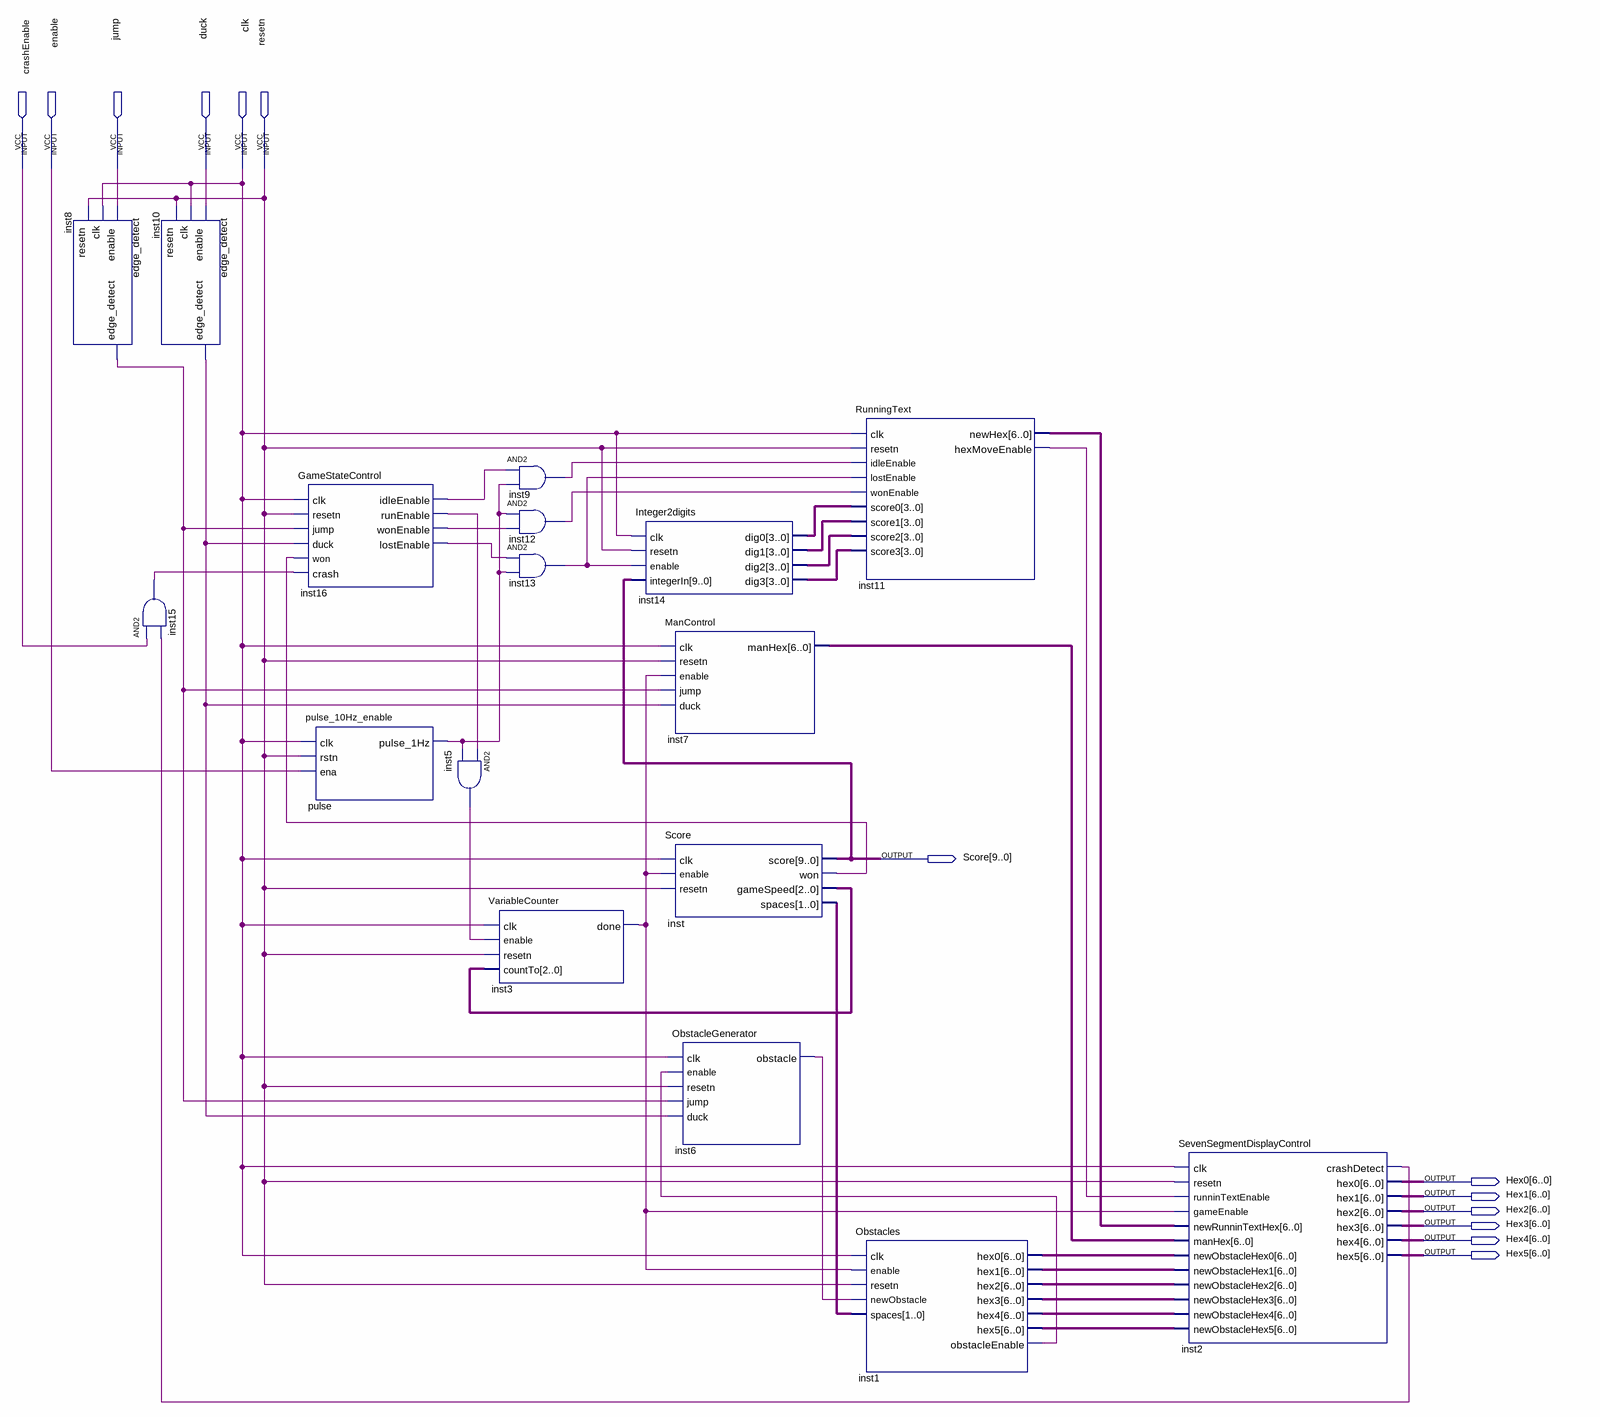
[diagram p0: schematic sheet]
// Quartus schematic CaveRunningGame.bdf as structural Verilog: 17 symbols, 13 pins
module CaveRunningGame (
  input  crashEnable,
  input  enable,
  input  jump,
  input  duck,
  input  clk,
  input  resetn,
  output [9:0] Score,
  output [6:0] Hex0,
  output [6:0] Hex1,
  output [6:0] Hex2,
  output [6:0] Hex3,
  output [6:0] Hex4,
  output [6:0] Hex5
);

  wire inst1_obstacleenable, inst2_crashdetect, inst3_done, inst5_out, inst6_obstacle, inst8_edge_detect,
       inst9_out, inst10_edge_detect, inst11_hexmoveenable, inst12_out, inst13_out, inst15_out,
       inst16_idleenable, inst16_lostenable, inst16_runenable, inst16_wonenable, inst_won, pulse_pulse_1hz;
  wire [1:0] inst_spaces;
  wire [2:0] inst_gamespeed;
  wire [3:0] inst14_dig0, inst14_dig1, inst14_dig2, inst14_dig3;
  wire [6:0] inst1_hex0, inst1_hex1, inst1_hex2, inst1_hex3, inst1_hex4, inst1_hex5, inst7_manhex,
       inst11_newhex;

  edge_detect inst8 (.enable(jump), .clk(clk), .resetn(resetn), .edge_detect(inst8_edge_detect));
  and inst15 (inst15_out, crashEnable, inst2_crashdetect);
  edge_detect inst10 (.enable(duck), .clk(clk), .resetn(resetn), .edge_detect(inst10_edge_detect));
  GameStateControl inst16 (
    .clk(clk), .resetn(resetn), .jump(inst8_edge_detect), .duck(inst10_edge_detect), .won(inst_won),
    .crash(inst15_out), .idleEnable(inst16_idleenable), .runEnable(inst16_runenable),
    .wonEnable(inst16_wonenable), .lostEnable(inst16_lostenable));
  pulse_10Hz_enable pulse (.clk(clk), .rstn(resetn), .ena(enable), .pulse_1Hz(pulse_pulse_1hz));
  and inst5 (inst5_out, inst16_runenable, pulse_pulse_1hz);
  VariableCounter inst3 (.clk(clk), .enable(inst5_out), .resetn(resetn), .countTo(inst_gamespeed), .done(inst3_done));
  and inst9 (inst9_out, inst16_idleenable, pulse_pulse_1hz);
  and inst12 (inst12_out, pulse_pulse_1hz, inst16_wonenable);
  and inst13 (inst13_out, inst16_lostenable, pulse_pulse_1hz);
  Integer2digits inst14 (
    .clk(clk), .resetn(resetn), .enable(inst13_out), .integerIn(Score), .dig0(inst14_dig0),
    .dig1(inst14_dig1), .dig2(inst14_dig2), .dig3(inst14_dig3));
  ManControl inst7 (
    .clk(clk), .resetn(resetn), .enable(inst3_done), .jump(inst8_edge_detect), .duck(inst10_edge_detect),
    .manHex(inst7_manhex));
  Score inst (
    .clk(clk), .enable(inst3_done), .resetn(resetn), .score(Score), .won(inst_won),
    .gameSpeed(inst_gamespeed), .spaces(inst_spaces));
  ObstacleGenerator inst6 (
    .clk(clk), .enable(inst1_obstacleenable), .resetn(resetn), .jump(inst8_edge_detect),
    .duck(inst10_edge_detect), .obstacle(inst6_obstacle));
  RunningText inst11 (
    .clk(clk), .resetn(resetn), .idleEnable(inst9_out), .lostEnable(inst13_out), .wonEnable(inst12_out),
    .score0(inst14_dig0), .score1(inst14_dig1), .score2(inst14_dig2), .score3(inst14_dig3),
    .newHex(inst11_newhex), .hexMoveEnable(inst11_hexmoveenable));
  Obstacles inst1 (
    .clk(clk), .enable(inst3_done), .resetn(resetn), .newObstacle(inst6_obstacle), .spaces(inst_spaces),
    .hex0(inst1_hex0), .hex1(inst1_hex1), .hex2(inst1_hex2), .hex3(inst1_hex3), .hex4(inst1_hex4),
    .hex5(inst1_hex5), .obstacleEnable(inst1_obstacleenable));
  SevenSegmentDisplayControl inst2 (
    .clk(clk), .resetn(resetn), .runninTextEnable(inst11_hexmoveenable), .gameEnable(inst3_done),
    .newRunninTextHex(inst11_newhex), .manHex(inst7_manhex), .newObstacleHex0(inst1_hex0),
    .newObstacleHex1(inst1_hex1), .newObstacleHex2(inst1_hex2), .newObstacleHex3(inst1_hex3),
    .newObstacleHex4(inst1_hex4), .newObstacleHex5(inst1_hex5), .crashDetect(inst2_crashdetect), .hex0(Hex0),
    .hex1(Hex1), .hex2(Hex2), .hex3(Hex3), .hex4(Hex4), .hex5(Hex5));
endmodule
